# Altium schematic sheet camera.SchDoc
size A4
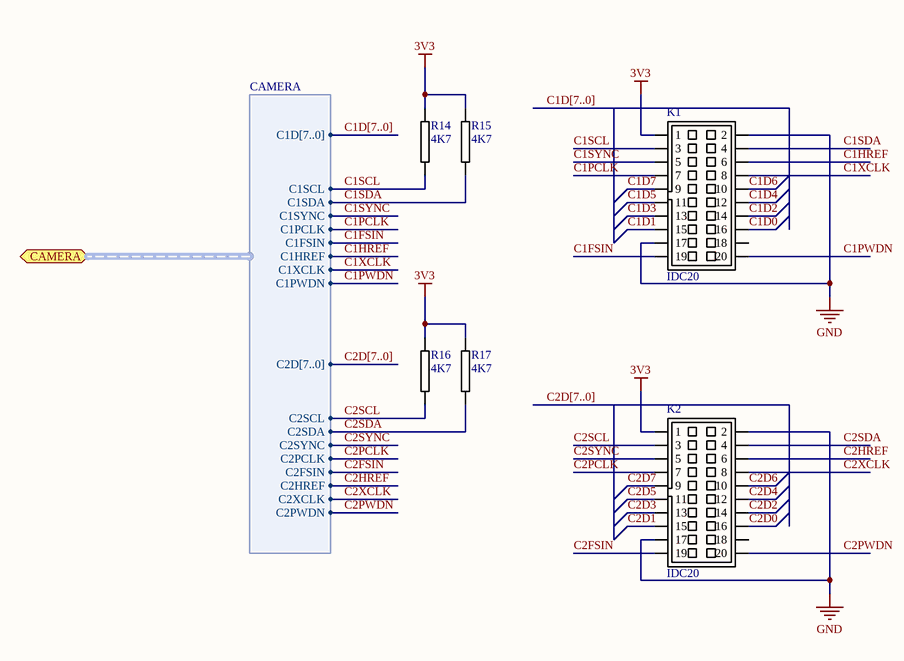
[diagram p0: camera.SchDoc]

## Parts
K1  IDC20  [HEADER20_FEMALE]
K2  IDC20  [HEADER20_FEMALE]
R14  4K7  [0603R-4K7]
R15  4K7  [0603R-4K7]
R16  4K7  [0603R-4K7]
R17  4K7  [0603R-4K7]

## Ports
CAMERA (harness CAMERA)

## Harnesses
CAMERA: C1D[7..0], C1SCL, C1SDA, C1SYNC, C1PCLK, C1FSIN, C1HREF, C1XCLK, C1PWDN, C2D[7..0], C2SCL, C2SDA, C2SYNC, C2PCLK, C2HREF, C2FSIN, C2XCLK, C2PWDN

## Nets
3V3: K1.1 K2.1 R14.1 R15.1 R16.1 R17.1
GND: K1.2 K1.17 K2.2 K2.17
C1D0: K1.16
C1D1: K1.15
C1D2: K1.14
C1D3: K1.13
C1D4: K1.12
C1D5: K1.11
C1D6: K1.10
C1D7: K1.9
C1FSIN: K1.19 ; port CAMERA.C1FSIN
C1HREF: K1.6 ; port CAMERA.C1HREF
C1PCLK: K1.7 ; port CAMERA.C1PCLK
C1PWDN: K1.20 ; port CAMERA.C1PWDN
C1SCL: K1.3 R14.2 ; port CAMERA.C1SCL
C1SDA: K1.4 R15.2 ; port CAMERA.C1SDA
C1SYNC: K1.5 ; port CAMERA.C1SYNC
C1XCLK: K1.8 ; port CAMERA.C1XCLK
C2D0: K2.16
C2D1: K2.15
C2D2: K2.14
C2D3: K2.13
C2D4: K2.12
C2D5: K2.11
C2D6: K2.10
C2D7: K2.9
C2FSIN: K2.19 ; port CAMERA.C2FSIN
C2HREF: K2.6 ; port CAMERA.C2HREF
C2PCLK: K2.7 ; port CAMERA.C2PCLK
C2PWDN: K2.20 ; port CAMERA.C2PWDN
C2SCL: K2.3 R16.2 ; port CAMERA.C2SCL
C2SDA: K2.4 R17.2 ; port CAMERA.C2SDA
C2SYNC: K2.5 ; port CAMERA.C2SYNC
C2XCLK: K2.8 ; port CAMERA.C2XCLK

Not connected (* = marked no-connect by the designer): K1 18; K2 18

## Buses and harness runs
bus C1D[7..0]
bus C2D[7..0]

## Library data of the parts
K1 K2 = IDC20: BOXHEADER 20 PIN; Manufacturer: Assmann Electronics Inc; Manufacturer Part Number: AWHW20G-0202-T-R; Description: CONN HEADER LOW-PRO 20POS GOLD; Number of Positions: 20; Number of Positions Loaded: All; Pitch: 0.100" (2.54mm); Connector Type: Header, Shrouded; Supplier 1: Digi-Key; Supplier Part Number 1: HRP20H-ND; Contact Type: Male Pin; Fastening Type: -; Contact Mating Length: -; Contact Finish Thickness: Flash; Number of Rows: 2; RoHS: RoHS Compliant; Category: Connectors, Interconnects; Packaging: Tray; Mounting Type: Through Hole; Contact Finish: Gold; Color: Gray; Features: -; Supplier: Digi-Key; Row Spacing: 0.100" (2.54mm); Supplier Part Number: HRP20H-ND; Termination: Solder
R14-R17 = 0603R-4K7: GENERIC RESISTOR 0603; Manufacturer: Stackpole Electronics Inc; Manufacturer Part Number: RMCF 1/16 4.7K 1% R; Description: RES 4.7K OHM 1/10W 1% 0603 SMD; Reel: R23; Supplier 1: Digi-Key; Supplier Part Number 1: RMCF1/164.7KFRTR-ND